# EAGLE design TRSW and RXamp FINAL mods (EAGLE 6.2)

## Sheet 1 of 2
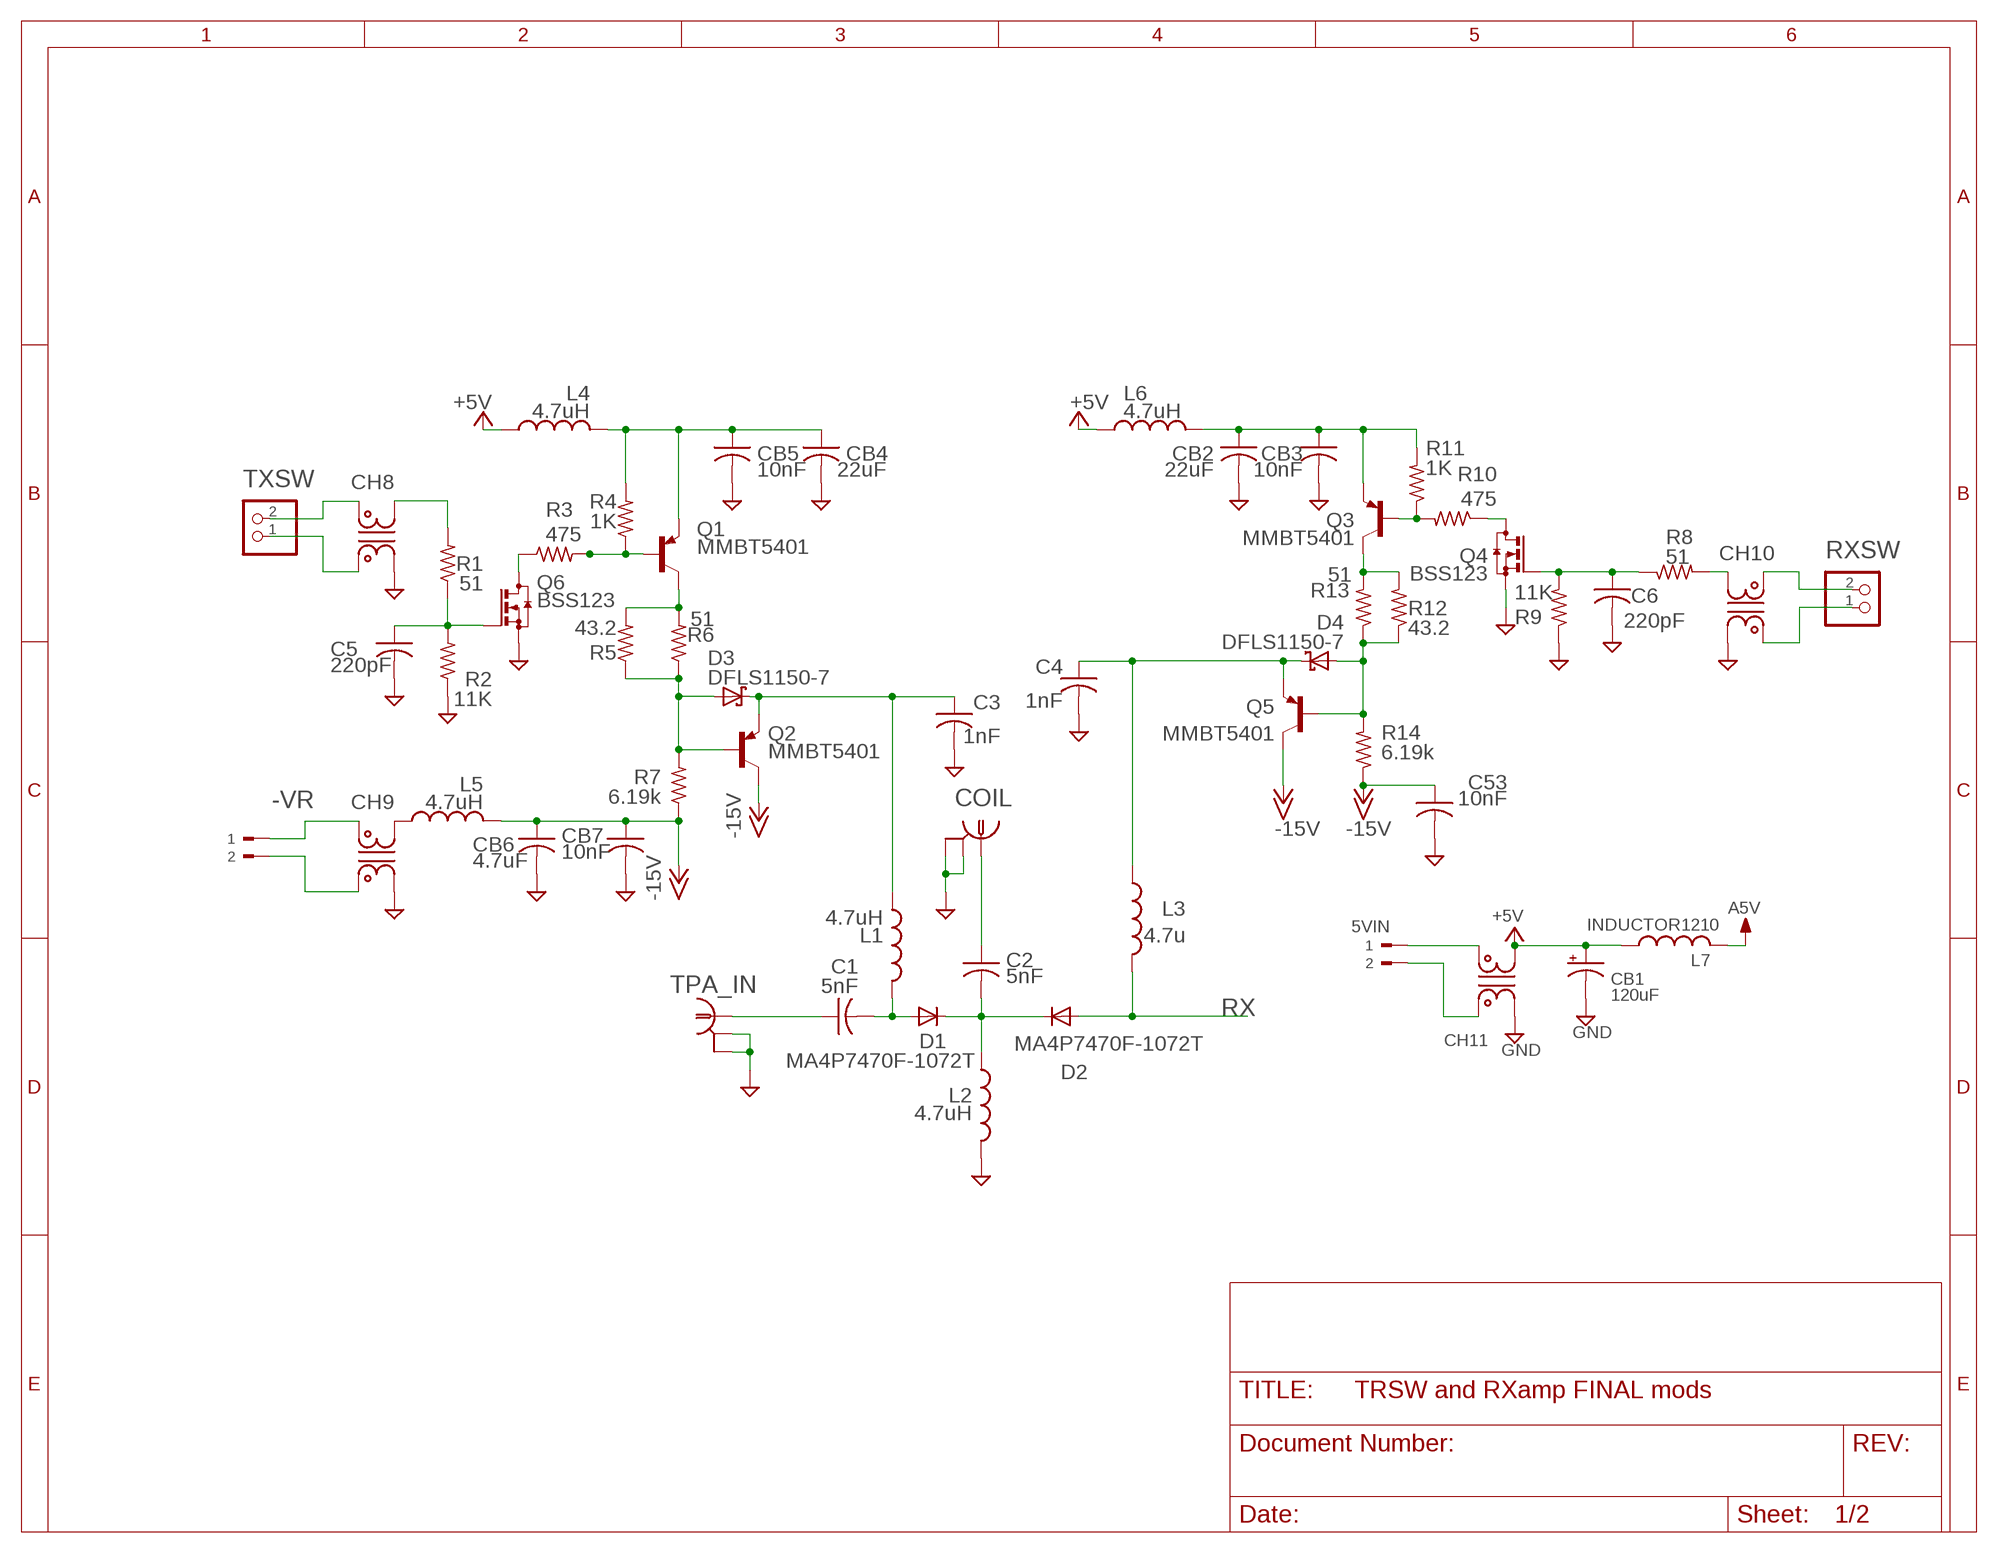
[diagram p0: schematic, sheet 1]

### Parts
5VIN  TERM-2OMNIMATE_SL  [OMNIMATE_SL_2POS]
-VR  TERM-2OMNIMATE_SL  [OMNIMATE_SL_2POS]
C1  5nF  CAPACITOR1008  [1008]
C2  5nF  CAPACITOR1008  [1008]
C3  1nF  C-USC0805  [C0805]
C4  1nF  C-USC0805  [C0805]
C5  220pF  C-USC0805  [C0805]
C6  220pF  C-USC0805  [C0805]
C53  10nF  C-USC0603  [C0603]
CB1  120uF  CPOL-USE3.5-8  [E3,5-8]
CB2  22uF  C-USC0805  [C0805]
CB3  10nF  C-USC0603  [C0603]
CB4  22uF  C-USC0805  [C0805]
CB5  10nF  C-USC0603  [C0603]
CB6  4.7uF  C-USC0805  [C0805]
CB7  10nF  C-USC0603  [C0603]
CH8  CHOKEDLW31S  [CHOKE_DLW31S]
CH9  CHOKE  [CHOKE_DLW5BT]
CH10  CHOKEDLW31S  [CHOKE_DLW31S]
CH11  CHOKE  [CHOKE_DLW5BT]
COIL  BNC-EDGE  [BNC-EDGE]
D1  MA4P7470F-1072T  DIODE  [1210-POLAR]
D2  MA4P7470F-1072T  DIODE  [1210-POLAR]
D3  DFLS1150-7  DIODE-SCHOTTKYPOWERDI-123  [POWERDI-123]
D4  DFLS1150-7  DIODE-SCHOTTKYPOWERDI-123  [POWERDI-123]
L1  4.7uH  INDUCTOR1210  [1210]
L2  4.7uH  INDUCTOR1210  [1210]
L3  4.7u  INDUCTOR1210  [1210]
L4  4.7uH  INDUCTOR1210  [1210]
L5  4.7uH  INDUCTOR1210  [1210]
L6  4.7uH  INDUCTOR1210  [1210]
L7  INDUCTOR1210  [1210]
Q1  MMBT5401  BF821SMD  [SOT23-BEC]
Q2  MMBT5401  BF821SMD  [SOT23-BEC]
Q3  MMBT5401  BF821SMD  [SOT23-BEC]
Q4  BSS123  [SOT23]
Q5  MMBT5401  BF821SMD  [SOT23-BEC]
Q6  BSS123  [SOT23]
R1  51  R-US_R0805  [R0805]
R2  11K  R-US_R0805  [R0805]
R3  475  R-US_R0805  [R0805]
R4  1K  R-US_R0805  [R0805]
R5  43.2  R-US_R0805  [R0805]
R6  51  R-US_R0805  [R0805]
R7  6.19k  R-US_R0805  [R0805]
R8  51  R-US_R0805  [R0805]
R9  11K  R-US_R0805  [R0805]
R10  475  R-US_R0805  [R0805]
R11  1K  R-US_R0805  [R0805]
R12  43.2  R-US_R0805  [R0805]
R13  51  R-US_R0805  [R0805]
R14  6.19k  R-US_R0805  [R0805]
RXSW  PINHD-1X2  [1X02]
TPA_IN  BNC-EDGE  [BNC-EDGE]
TXSW  PINHD-1X2  [1X02]

### Nets
+5V: CB1.+ CH11.P$3 L4.1 L6.2 L7.1
-15V: C53.1 CB6.1 CB7.1 L5.2 Q2.C Q5.C R7.1 R14.1
A5V: L7.2 ; also sheet 2
GND: C3.2 C4.2 C5.2 C6.2 C53.2 CB1.- CB2.2 CB3.2 CB4.2 CB5.2 CB6.2 CB7.2 CH8.P$2 CH9.P$2 CH10.P$2 CH11.P$2 COIL.S1(GND1) COIL.S2(GND2) L2.2 Q4.2(S) Q6.2(S) R2.1 R9.1 TPA_IN.S1(GND1) TPA_IN.S2(GND2) ; also sheet 2
LNAIN: D2.A L3.2 ; also sheet 2
N$1: D3.A Q2.B R5.1 R6.1 R7.2
N$2: C3.1 D3.K(C) L1.1 Q2.E
N$3: Q1.C R5.2 R6.2
N$4: Q1.B R3.2 R4.1
N$5: CH9.P$3 L5.1
N$6: C1.P$1 TPA_IN.I
N$7: C1.P$2 D1.A L1.2
N$8: C2.P$2 D1.K(C) D2.K(C) L2.1
N$12: CH8.P$3 R1.2
N$13: C2.P$1 COIL.I
N$15: CH10.P$3 R8.2
N$16: CH10.P$4 RXSW.2
N$17: CH10.P$1 RXSW.1
N$18: CH8.P$4 TXSW.2
N$19: CH8.P$1 TXSW.1
N$22: 5VIN.1 CH11.P$4
N$23: 5VIN.2 CH11.P$1
N$24: -VR.1 CH9.P$4
N$25: -VR.2 CH9.P$1
N$29: D4.A Q5.B R12.1 R13.1 R14.2
N$36: C4.1 D4.K(C) L3.1 Q5.E
N$37: Q3.C R12.2 R13.2
N$38: Q3.B R10.2 R11.1
N$109: C6.1 Q4.1(G) R8.1 R9.2
N$110: Q6.3(D) R3.1
N$111: Q4.3(D) R10.1
N$112: C5.1 Q6.1(G) R1.1 R2.2
N$113: CB4.1 CB5.1 L4.2 Q1.E R4.2
N$114: CB2.1 CB3.1 L6.1 Q3.E R11.2

### Notes on the sheet
- RX

## Sheet 2 of 2
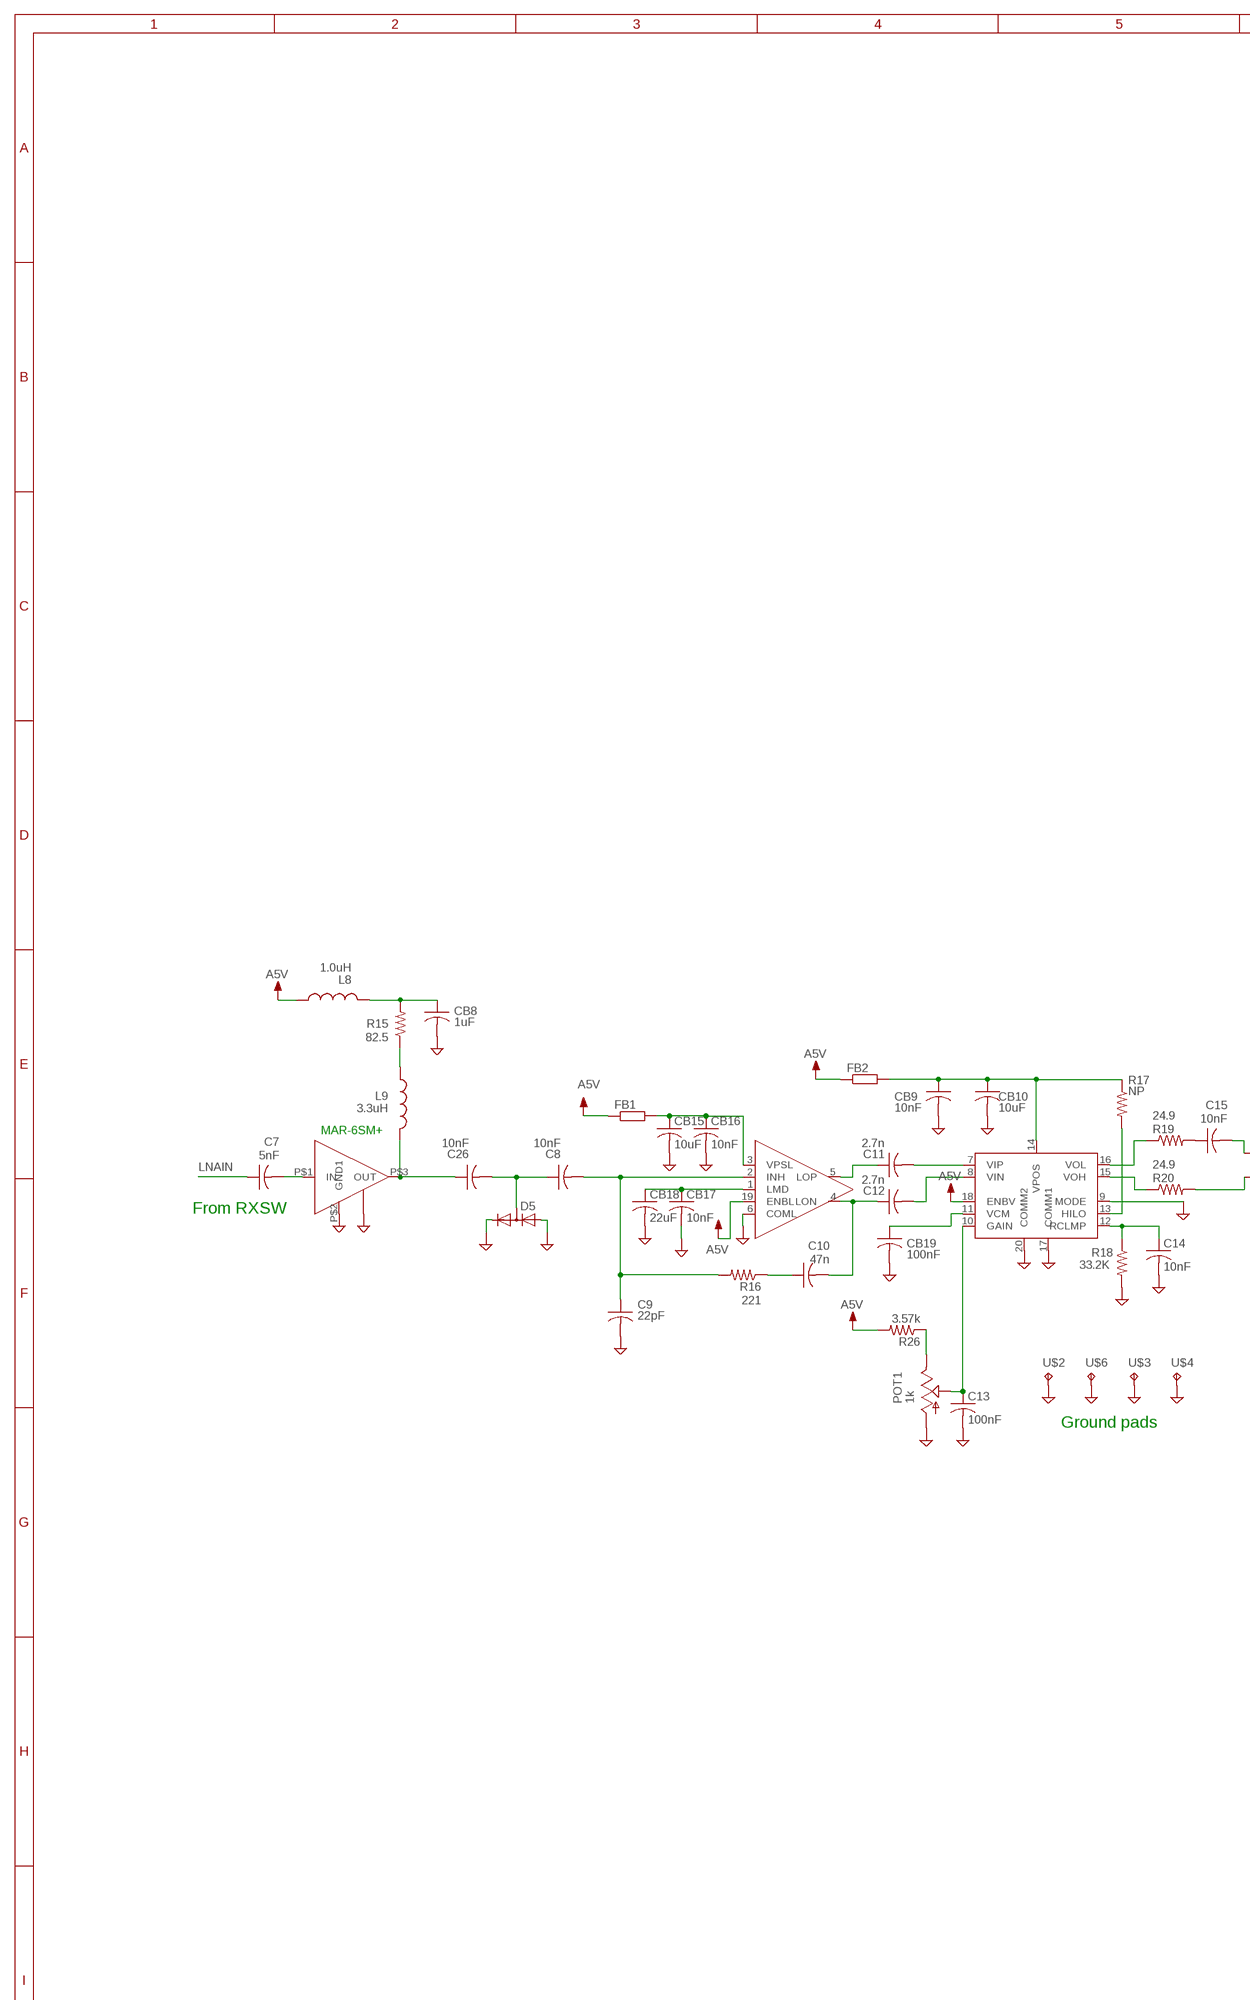
[diagram p1: schematic, sheet 2, part 1 of 2]
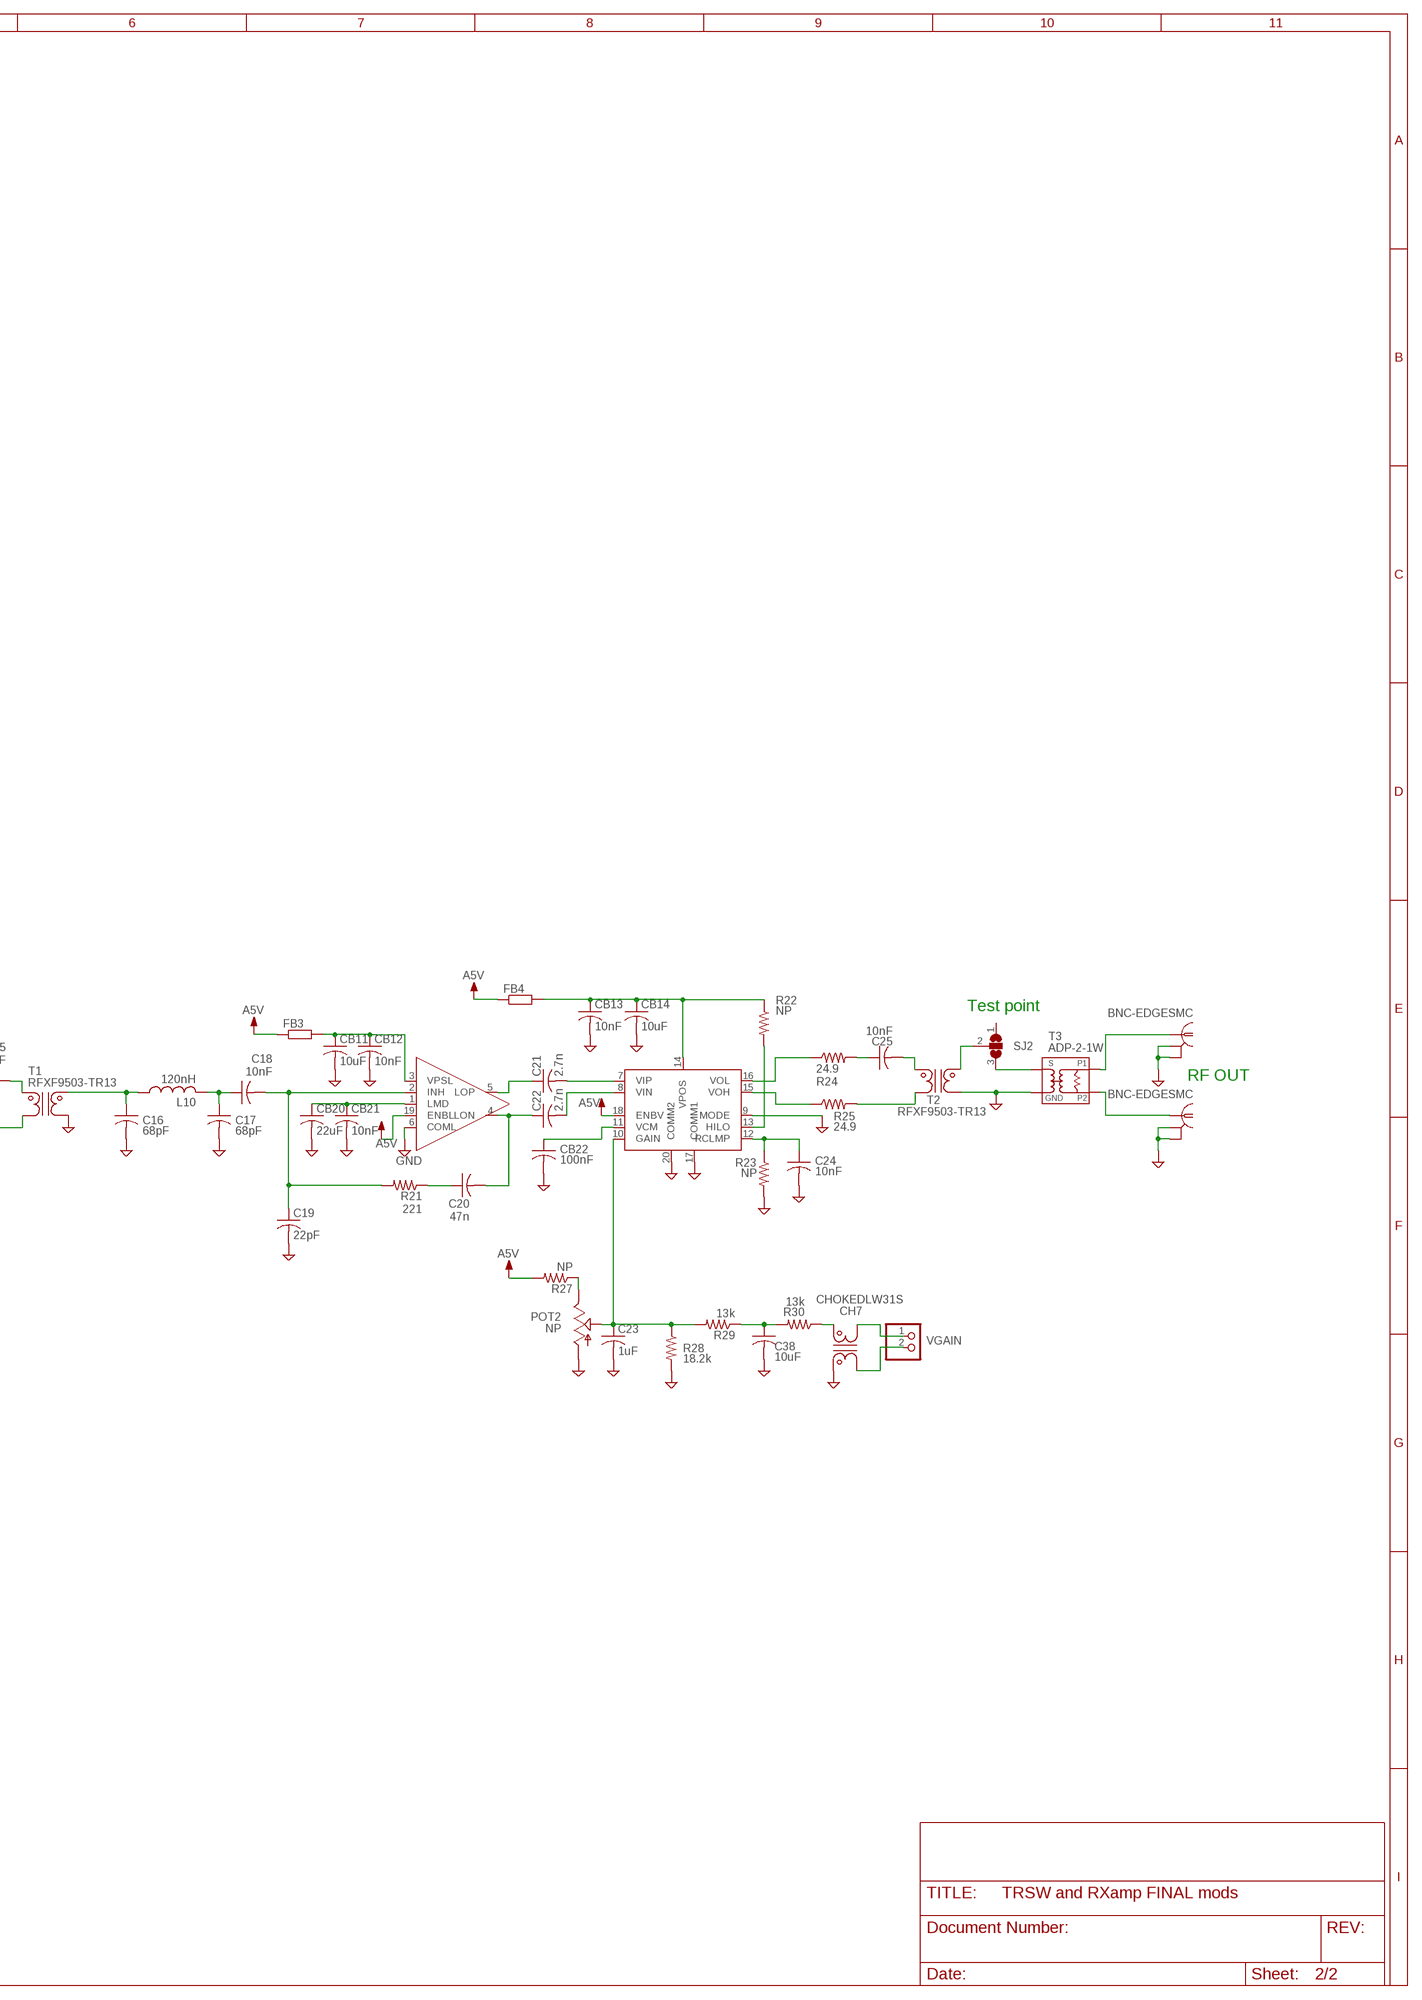
[diagram p2: schematic, sheet 2, part 2 of 2]

### Parts
C7  5nF  CAPACITOR1008  [1008]
C8  10nF  C-USC0805  [C0805]
C9  22pF  C-USC0805  [C0805]
C10  47n  C-USC0805  [C0805]
C11  2.7n  C-USC0603  [C0603]
C12  2.7n  C-USC0603  [C0603]
C13  100nF  C-USC0603  [C0603]
C14  10nF  C-USC0603  [C0603]
C15  10nF  C-USC0603  [C0603]
C16  68pF  CAPACITOR1008  [1008]
C17  68pF  CAPACITOR1008  [1008]
C18  10nF  C-USC0805  [C0805]
C19  22pF  C-USC0805  [C0805]
C20  47n  C-USC0805  [C0805]
C21  2.7n  C-USC0603  [C0603]
C22  2.7n  C-USC0603  [C0603]
C23  1uF  C-USC0805  [C0805]
C24  10nF  C-USC0603  [C0603]
C25  10nF  C-USC0603  [C0603]
C26  10nF  C-USC0805  [C0805]
C38  10uF  C-USC0805  [C0805]
CB8  1uF  C-USC0805  [C0805]
CB9  10nF  C-USC0603  [C0603]
CB10  10uF  C-USC0805  [C0805]
CB11  10uF  C-USC0805  [C0805]
CB12  10nF  C-USC0603  [C0603]
CB13  10nF  C-USC0603  [C0603]
CB14  10uF  C-USC0805  [C0805]
CB15  10uF  C-USC0805  [C0805]
CB16  10nF  C-USC0603  [C0603]
CB17  10nF  C-USC0603  [C0603]
CB18  22uF  C-USC0805  [C0805]
CB19  100nF  C-USC0603  [C0603]
CB20  22uF  C-USC0805  [C0805]
CB21  10nF  C-USC0603  [C0603]
CB22  100nF  C-USC0603  [C0603]
CH7  CHOKEDLW31S  [CHOKE_DLW31S]
D5  DIODE_2CACA-SOT23  [SOT23]
FB1  R-EU_R0603  [R0603]
FB2  R-EU_R0603  [R0603]
FB3  R-EU_R0603  [R0603]
FB4  R-EU_R0603  [R0603]
L8  1.0uH  INDUCTOR1008  [1008]
L9  3.3uH  INDUCTOR1008  [1008]
L10  120nH  INDUCTOR1008  [1008]
LNA  MAR-6SM+  [WW107]
POT1  1k  TRIM_US-3223W  [3223W]
POT2  NP  TRIM_US-3223W  [3223W]
R15  82.5  R-US_R0805  [R0805]
R16  221  R-US_R0805  [R0805]
R17  NP  R-US_R0805  [R0805]
R18  33.2K  R-US_R0805  [R0805]
R19  24.9  R-US_R0805  [R0805]
R20  24.9  R-US_R0805  [R0805]
R21  221  R-US_R0805  [R0805]
R22  NP  R-US_R0805  [R0805]
R23  NP  R-US_R0805  [R0805]
R24  24.9  R-US_R0805  [R0805]
R25  24.9  R-US_R0805  [R0805]
R26  3.57k  R-US_R0805  [R0805]
R27  NP  R-US_R0805  [R0805]
R28  18.2k  R-US_R0805  [R0805]
R29  13k  R-US_R0805  [R0805]
R30  13k  R-US_R0805  [R0805]
RF_OUT  BNC-EDGESMC  [SMC-EDGE]
SJ2  SJ2W  [SJ_2]
T1  RFXF9503-TR13  BALUN_1:1  [CX20XX_BALUN]
T2  RFXF9503-TR13  BALUN_1:1  [CX20XX_BALUN]
T3  ADP-2-1W  [CD636]
U1  AD8331  [QSOP-20]
U2  AD8331  [QSOP-20]
U$2  TESTPOINTKEYSTONE_ELECTRONICS_5016  [SMD_TESTPAD]
U$3  TESTPOINTKEYSTONE_ELECTRONICS_5016  [SMD_TESTPAD]
U$4  TESTPOINTKEYSTONE_ELECTRONICS_5016  [SMD_TESTPAD]
U$6  SOLDERPADSMALL  [PAD-SMALL]
U$27  BNC-EDGESMC  [SMC-EDGE]
VGAIN  PINHD-1X2  [1X02]

### Nets
A5V: FB1.1 FB2.1 FB3.1 FB4.1 L8.P$1 R26.2 R27.2 U1.18(ENBV) U1.19(ENBL) U2.18(ENBV) U2.19(ENBL) ; also sheet 1
GND: C9.2 C13.2 C14.2 C16.P$2 C17.P$2 C19.2 C23.2 C24.2 C38.2 CB8.2 CB9.2 CB10.2 CB11.2 CB12.2 CB13.2 CB14.2 CB15.2 CB16.2 CB17.2 CB18.2 CB19.2 CB20.2 CB21.2 CB22.2 CH7.P$1 D5.1(A) D5.2(C) LNA.P$2(GND1) LNA.P$4(GND2) POT1.1(A) POT2.1(A) R18.2 R23.2 R28.2 RF_OUT.2(GND1) RF_OUT.3(GND2) T1.P$3 T2.P$3 T3.P$6(GND) U1.6(COML) U1.9(MODE) U1.17(COMM1) U1.20(COMM2) U2.6(COML) U2.9(MODE) U2.17(COMM1) U2.20(COMM2) U$2.P$1(TP) U$3.P$1(TP) U$4.P$1(TP) U$6.P$1(TP) U$27.2(GND1) U$27.3(GND2) ; also sheet 1
LNAIN: C7.P$1 ; also sheet 1
N$9: C16.P$1 L10.P$1 T1.P$4
N$10: C17.P$1 C18.1 L10.P$2
N$11: C8.2 C9.1 R16.2 U1.2(INH)
N$14: CH7.P$4 R30.1
N$20: CH7.P$3 VGAIN.1
N$21: CH7.P$2 VGAIN.2
N$26: C8.1 C26.2 D5.3(AC)
N$27: C26.1 L9.P$2 LNA.P$3(OUT)
N$28: L9.P$1 R15.1
N$30: CB8.1 L8.P$2 R15.2
N$31: C7.P$2 LNA.P$1(IN)
N$32: C11.1 U1.5(LOP)
N$33: C11.2 U1.7(VIP)
N$34: C12.2 U1.8(VIN)
N$35: C10.2 C12.1 U1.4(LON)
N$42: C15.1 R19.2
N$43: C10.1 R16.1
N$44: CB17.1 CB18.1 U1.1(LMD)
N$45: CB15.1 CB16.1 FB1.2 U1.3(VPSL)
N$46: CB19.1 U1.11(VCM)
N$47: R19.1 U1.16(VOL)
N$48: R20.1 U1.15(VOH)
N$49: C14.1 R18.1 U1.12(RCLMP)
N$53: CB9.1 CB10.1 FB2.2 R17.1 U1.14(VPOS)
N$54: R20.2 T1.P$1
N$55: R17.2 U1.13(HILO)
N$56: C15.2 T1.P$5
N$58: C13.1 POT1.2(S) U1.10(GAIN)
N$68: POT1.3(E) R26.1
N$73: C18.2 C19.1 R21.2 U2.2(INH)
N$76: C21.1 U2.5(LOP)
N$77: C21.2 U2.7(VIP)
N$78: C22.2 U2.8(VIN)
N$81: C20.2 C22.1 U2.4(LON)
N$82: C20.1 R21.1
N$83: CB20.1 CB21.1 U2.1(LMD)
N$84: CB11.1 CB12.1 FB3.2 U2.3(VPSL)
N$87: CB22.1 U2.11(VCM)
N$89: R24.1 U2.16(VOL)
N$90: R25.1 U2.15(VOH)
N$91: C24.1 R23.1 U2.12(RCLMP)
N$92: CB13.1 CB14.1 FB4.2 R22.1 U2.14(VPOS)
N$93: R22.2 U2.13(HILO)
N$94: C25.1 R24.2
N$95: R25.2 T2.P$1
N$96: C25.2 T2.P$5
N$97: C23.1 POT2.2(S) R28.1 R29.2 U2.10(GAIN)
N$98: POT2.3(E) R27.1
N$99: T3.P$4(P2) U$27.1
N$100: RF_OUT.1 T3.P$3(P1)
N$101: SJ2.2 T2.P$4
N$102: SJ2.3 T3.P$1(S)
RTY5: C38.1 R29.1 R30.2
Unconnected: SJ2.1

### Notes on the sheet
- Test point
- MAR-6SM+
- RF OUT
- From RXSW
- Ground pads

## Library data of the parts
5VIN -VR = amyparts-rf-combined:TERM-2
C1 C2 C7 C16 C17 = amyparts-rf:CAPACITOR
C3-C6 C8-C15 C18-C26 C38 C53 CB2-CB22 = rcl:C-US: CAPACITOR, American symbol
CB1 = rcl:CPOL-US: POLARIZED CAPACITOR, American symbol
CH7-CH11 = amyparts-rf-combined:CHOKE
COIL RF_OUT TPA_IN U$27 = amyparts-rf:BNC-EDGE
D1 D2 = amyparts-rf-combined:DIODE
D3 D4 = amyparts-rf:DIODE-SCHOTTKY
D5 = diode:DIODE_2CACA-: 2 Diodes - Cathode-Anode|Cathode-Anode
FB1-FB4 = rcl:R-EU_: RESISTOR, European symbol
L1-L10 = amyparts-rf:INDUCTOR
LNA = amyparts-rf:MAR-6SM+
POT1 POT2 = amyparts-rf-combined:TRIM_US-: POTENTIOMETER
Q1-Q3 Q5 = transistor-pnp:BF821*: PNP Transistror
Q4 Q6 = transistor-small-signal:BSS123: N-CHANNEL MOS FET
R1-R30 = rcl:R-US_: RESISTOR, American symbol
RXSW TXSW VGAIN = pinhead:PINHD-1X2: PIN HEADER
SJ2 = jumper:SJ2W: SMD solder JUMPER
T1 T2 = amyparts-rf-combined:BALUN_1:1
T3 = amyparts-rf-combined:ADP-2-1W
U1 U2 = amyparts-rf-combined:AD8331
U$2-U$4 = amyparts-rf-combined:TESTPOINT
U$6 = amyparts-rf-combined:SOLDERPAD

## Board
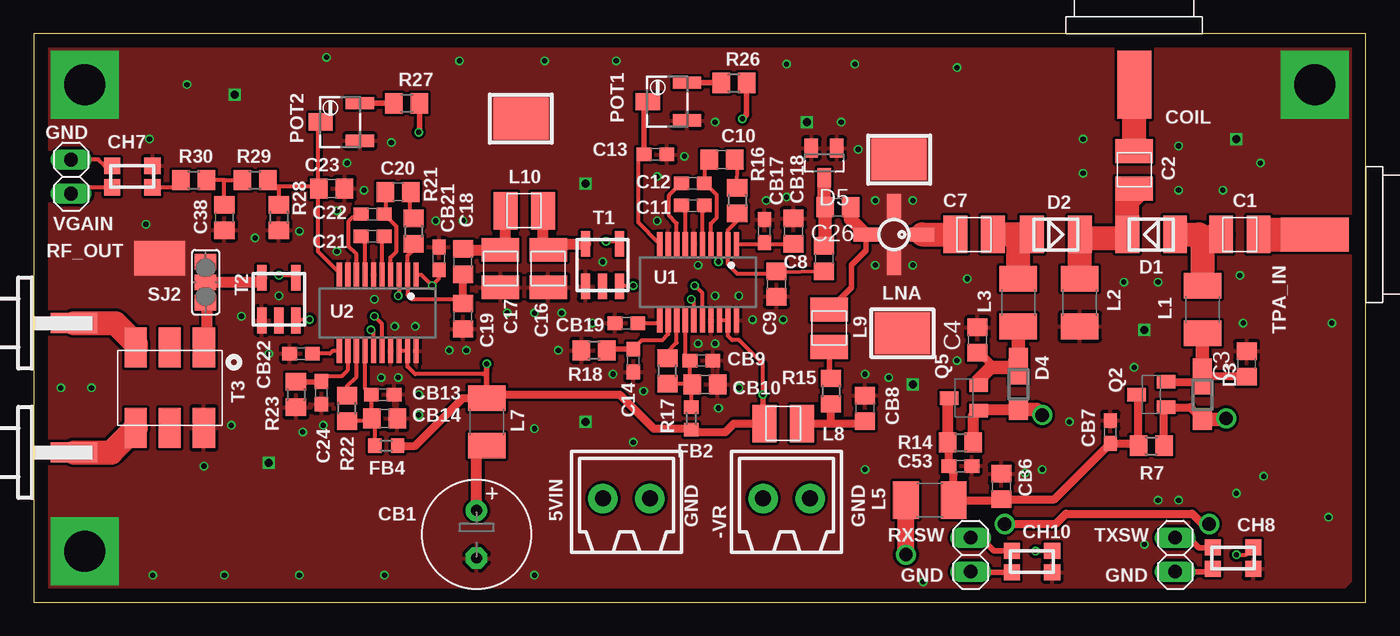
[diagram p3: board, top side]
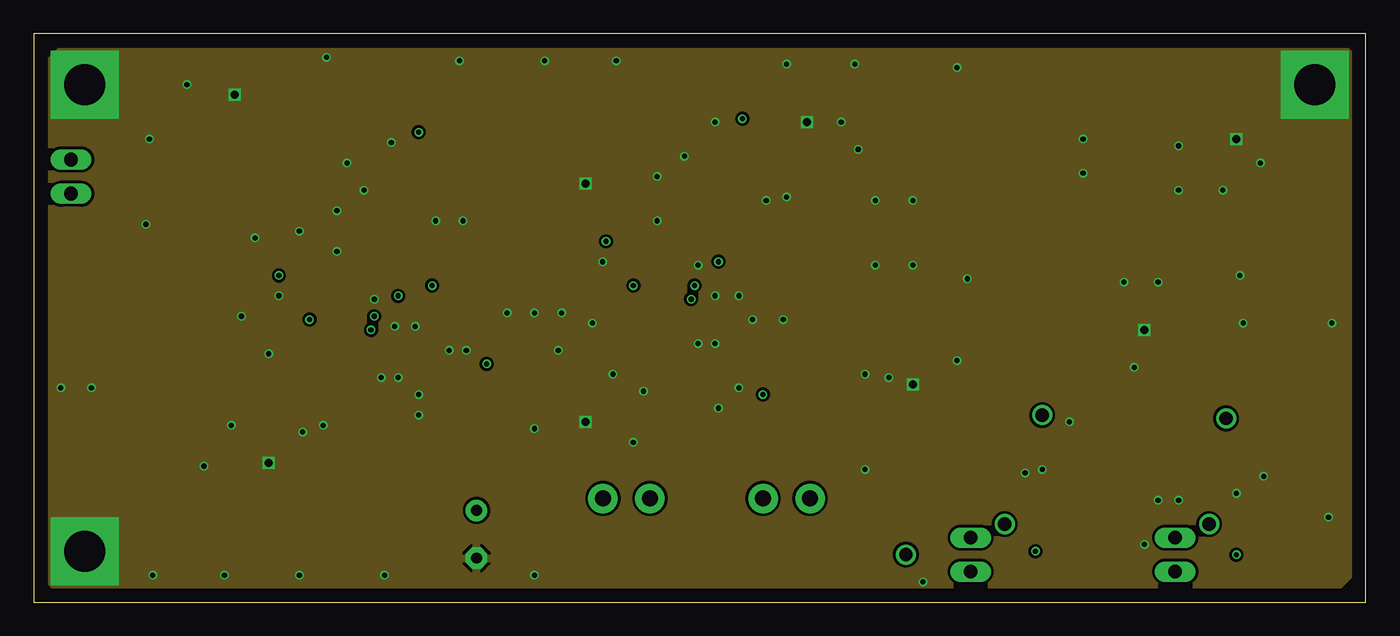
[diagram p4: board, inner layer Route15]
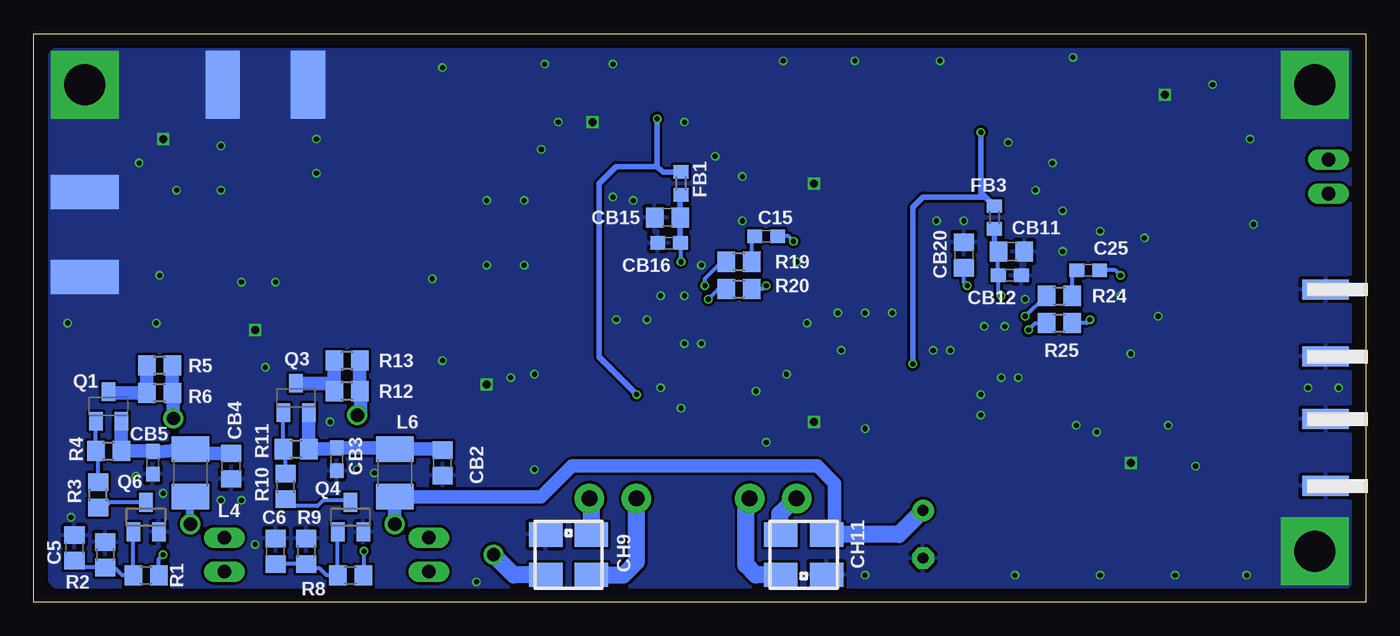
[diagram p5: board, bottom side, seen from below]

Size 99.31 x 42.42 mm. Coordinates in mm from the lower left corner, seen from the top.
Outline: 99.31,42.42 0,42.42 0,0 99.31,0 99.31,42.42
Copper layers (1*2+15*16): Top 0.035mm / dielectric 1.5mm / Route2 0.035mm / dielectric 0.15mm / Route15 0.035mm / dielectric 0.2mm / Bottom 0.035mm
Design rules: minimum track width 10mil, minimum drill 15mil, track to track 8mil, track to pad 8mil, pad to pad 8mil, via to via 8mil, smd to smd 2mil, copper to edge 40mil, drill to drill 8mil, minimum pad ring 5mil, minimum via ring 5mil, stop-mask expansion 4mil, vias tented up to drill 0mil, thermal gap 10mil

### Footprints (pad centres in the part's own frame; a part is rotated, then mirrored left to right if it is on the bottom)
OMNIMATE_SL_2POS = drill 1.2 pad 2.2: 1 -1.75,0; 2 1.75,0
1008 = smd 1.778 x 2.794: P$1 -1.397,0; P$2 1.397,0
C0805 = smd 1.3 x 1.5: 1 -0.95,0; 2 0.95,0
C0603 = smd 1.1 x 1: 1 -0.85,0; 2 0.85,0
E3,5-8 = drill 0.813 pad 1.6: + -1.778,0 | drill 0.813 pad 1.6 octagon: - 1.778,0
CHOKE_DLW31S = smd 1.2 x 1.2: P$1 -1.5,-0.8; P$2 1.5,-0.8; P$3 1.5,0.8; P$4 -1.5,0.8
CHOKE_DLW5BT = smd 2.5 x 1.8: P$1 -1.7,-1.5; P$2 1.7,-1.5; P$3 1.7,1.5; P$4 -1.7,1.5
BNC-EDGE = smd 5.08 x 2.54: I 2.54,0 | smd 5.08 x 2.54 bottom: S1 2.54,3.175; S2 2.54,-3.175
1210-POLAR = smd 1.778 x 2.794: A -1.778,0; K 1.778,0
POWERDI-123 = smd 1.6 x 1.4: A 1.85,0 | smd 2.7 x 1.4: K -1.35,0
SOT23 = smd 1 x 1.4: 1 -0.95,-1.1; 2 0.95,-1.1; 3 0,1.1
R0603 = smd 1 x 1.1: 1 -0.85,0; 2 0.85,0
1210 = smd 1.905 x 2.794: 1 -1.778,0; 2 1.778,0
WW107 = smd 1.05 x 1.85: P$1 0,-2.1; P$3 0,2.1 | smd 1.85 x 1.05: P$2 2.1,0; P$4 -2.1,0
3223W = smd 0.9 x 2.108: 1 -1.4,-1.469; 3 1.4,-1.469 | smd 1.3 x 1.808: 2 0,1.469
SOT23-BEC = smd 1 x 1.4: B -0.95,-1.1; C 0,1.1; E 0.95,-1.1
R0805 = smd 1.3 x 1.5: 1 -0.95,0; 2 0.95,0
SMC-EDGE = smd 3.5 x 1.5: 1 3.14,0 | smd 3.5 x 1.5 bottom: 2 3.14,2.5; 3 3.14,-2.5
1X02 = drill 1.016 long: 1 -1.27,0; 2 1.27,0
SJ_2 = smd 1.168 x 1.6: 1 -1.524,0; 2 0,0; 3 1.524,0
CX20XX_BALUN = smd 0.762 x 1.905: P$1 1.27,-1.587; P$2 0,-1.587; P$3 -1.27,-1.587; P$4 -1.27,1.587; P$5 1.27,1.587
CD636 = smd 1.65 x 3: P$1 -2.54,-3; P$2 0,-3; P$3 2.54,-3; P$4 2.54,3; P$5 0,3; P$6 -2.54,3
QSOP-20 = smd 0.381 x 1.778: 1 -2.857,-2.854; 2 -2.223,-2.854; 3 -1.587,-2.854; 4 -0.953,-2.854; 5 -0.318,-2.854; 6 0.318,-2.854; 7 0.953,-2.854; 8 1.587,-2.854; 9 2.223,-2.854; 10 2.857,-2.854; 11 2.857,2.854; 12 2.223,2.854; 13 1.587,2.854; 14 0.953,2.854; 15 0.318,2.854; 16 -0.318,2.854; 17 -0.953,2.854; 18 -1.587,2.854; 19 -2.223,2.854; 20 -2.857,2.854
SMD_TESTPAD = smd 4.1 x 3.1: P$1 0,0
PAD-SMALL = smd 3.81 x 2.54: P$1 0,0

### Placement (x,y rotation side)
5VIN  44.2,7.75 0 top
-VR  56.13,7.75 0 top
C1  89.92,27.43 180 top
C2  82.04,32.26 270 top
C3  90.42,17.78 90 top
C4  70.36,19.56 90 top
C5  96.27,4.06 90 bottom
C6  81.28,3.81 90 bottom
C7  70.1,27.43 180 top
C8  58.93,25.65 270 top
C9  55.37,23.75 270 top
C10  51.31,33.02 180 top
C11  49.15,29.59 180 top
C12  49.15,31.24 180 top
C13  46.35,33.4 0 top
C14  44.7,18.03 270 top
C15  44.7,27.3 0 bottom
C16  38.35,24.89 270 top
C17  34.8,24.89 270 top
C18  32,25.4 270 top
C19  32,21.34 270 top
C20  27.18,30.61 180 top
C21  25.27,27.3 180 top
C22  25.27,28.96 180 top
C23  22.23,30.86 0 top
C24  21.46,15.62 270 top
C25  20.7,24.77 0 bottom
C26  59.94,29.46 180 top
C38  14.22,28.7 270 top
C53  69.09,10.16 0 top
CB1  33.02,5.08 270 top
CB2  68.83,10.41 270 bottom
CB3  76.71,10.67 270 bottom
CB4  84.58,10.16 270 bottom
CB5  90.42,10.41 270 bottom
CB6  72.14,8.64 90 top
CB7  80.26,12.7 90 top
CB8  61.98,14.48 90 top
CB9  49.78,18.03 0 top
CB10  50.04,16.26 0 top
CB11  26.42,26.16 0 bottom
CB12  26.54,24.38 0 bottom
CB13  26.04,15.49 0 top
CB14  26.16,13.72 0 top
CB15  52.07,28.7 180 bottom
CB16  51.94,26.8 180 bottom
CB17  54.48,27.69 90 top
CB18  56.64,27.69 90 top
CB19  44.2,20.83 180 top
CB20  29.97,25.91 90 bottom
CB21  30.23,25.65 90 top
CB22  19.94,18.54 180 top
CH7  7.37,31.75 180 top
CH8  89.41,3.3 0 top
CH9  59.44,3.56 180 bottom
CH10  74.42,3.05 0 top
CH11  41.91,3.56 0 bottom
COIL  82.04,41.15 270 top
D1  83.31,27.43 180 top
D2  76.2,27.43 0 top
D3  87.12,15.49 270 top
D4  73.41,16.26 270 top
D5  58.93,32.77 180 top
FB1  51.05,31.24 270 bottom
FB2  49.02,13.72 90 top
FB3  27.69,28.7 270 bottom
FB4  26.29,11.68 180 top
L1  87.12,21.84 90 top
L2  77.98,22.35 270 top
L3  73.41,22.35 90 top
L4  87.63,9.65 90 bottom
L5  66.8,7.62 0 top
L6  72.39,9.65 270 bottom
L7  33.78,13.46 90 top
L8  55.88,13.34 0 top
L9  59.31,20.45 90 top
L10  36.58,29.21 180 top
LNA  64.14,27.43 90 top
POT1  47.24,37.34 90 top
POT2  22.86,35.81 90 top
Q1  93.73,14.61 0 bottom
Q2  83.31,15.49 90 top
Q3  79.76,15.24 0 bottom
Q4  75.69,6.35 0 bottom
Q5  69.34,15.24 90 top
Q6  90.93,6.35 0 bottom
R1  90.93,2.03 0 bottom
R2  93.98,3.56 270 bottom
R3  94.49,8 90 bottom
R4  93.73,11.3 0 bottom
R5  89.92,17.65 180 bottom
R6  89.92,15.62 180 bottom
R7  83.31,11.68 0 top
R8  75.69,2.03 0 bottom
R9  78.99,3.81 270 bottom
R10  80.52,8.64 90 bottom
R11  79.76,11.43 0 bottom
R12  75.95,15.75 180 bottom
R13  75.95,18.03 180 bottom
R14  69.09,11.94 0 top
R15  59.44,15.75 270 top
R16  52.45,29.97 270 top
R17  47.24,17.27 90 top
R18  41.78,18.8 180 top
R19  46.74,25.4 0 bottom
R20  46.74,23.37 0 bottom
R21  28.32,27.69 270 top
R22  23.37,14.48 90 top
R23  19.56,15.49 270 top
R24  22.86,22.86 0 bottom
R25  22.86,20.83 0 bottom
R26  52.2,38.73 0 top
R27  27.81,37.21 0 top
R28  18.29,28.7 270 top
R29  16.51,31.5 0 top
R30  11.94,31.5 0 top
RF_OUT  -0.13,20.83 0 top
RXSW  69.85,3.56 90 top
SJ2  12.83,23.88 270 top
T1  42.42,25.15 0 top
T2  18.29,22.61 0 top
T3  10.16,16 180 top
TPA_IN  98.04,27.43 180 top
TXSW  85.09,3.56 90 top
U1  49.53,23.88 180 top
U2  25.65,21.59 180 top
U$2  64.77,20.07 0 top
U$3  64.52,33.02 180 top
U$4  36.32,36.07 0 top
U$6  9.4,25.65 180 top
U$27  -0.13,11.18 0 top
VGAIN  2.79,31.75 90 top

### Tracks (layer width: path | path; a pad name or v marks a point on that pad's centre or on a via)
+5V  (via drill 1)
  Top 0.61: v72.39,5.84 76.2,5.84 76.96,6.6 86.36,6.6 87.38,5.59 v87.63,5.84
  Top 0.813: CB1.+ 33.02,11.43 L7.1
  Bottom 0.61: v87.63,5.84 L4.1
  Bottom 1.016: v72.39,5.84 L6.2 61.47,7.87 59.18,10.16 40.89,10.16 39.62,8.89 39.62,5.06
  Bottom 1.27: CH11.P$3 39.62,5.06 34.82,5.06 CB1.+
-15V
  Top 0.61: Q2.C 82.36,15.34 R7.1 82.2,11.85 CB7.1 76.1,7.69 CB6.1 71.82,7.62 L5.2 68.58,9.56 C53.1 68.24,11.33 R14.1
  Top 0.813: R14.1 68.14,15.14 Q5.C
A5V  (via drill 0.38)
  Top 0.305: U1.18 U1.19 51.75,19.88 52.07,19.56 52.58,19.56 54.36,17.78 v54.36,15.49 | U2.18 U2.19 27.88,17.59 28.45,17.02 33.53,17.02 33.78,17.27
  Top 0.406: R27.2 28.76,35.11 v28.7,35.05 | L7.2 33.78,17.27 v33.78,17.78 | R26.2 53.15,36.38 v52.83,36.07 | v54.36,15.49 54.36,12.95 L8.P$1
  Top 0.61: FB4.1 28.45,11.68 32,15.24 L7.2 34.04,15.49 43.69,15.49 46.23,12.95 48.77,12.95 48.86,12.87 FB2.1 48.77,12.79 49.02,12.95 | 49.02,12.95 49.4,12.83 49.02,12.95 | 49.02,12.95 49.28,12.7 51.56,12.7 52.2,13.34 L8.P$1
  Bottom 0.406: v28.7,35.05 28.7,30.57 FB3.1 28.36,30.23 33.02,30.23 33.78,29.46 v33.78,17.78 | 52.83,32.51 v52.83,36.07 | 52.83,32.51 55.88,32.51 57.15,31.24 57.15,18.29 v54.36,15.49 | FB1.1 52.41,32.09 52.83,32.51
GND  (via drill 0.38, 0.6, 3.05 pad 5.08)
  other vias: 3.81,38.61 3.81,3.81 95.5,38.61 11.43,38.61 23.37,32.77 26.67,34.29 22.61,26.16 15.49,21.34 17.53,18.54 14.73,13.21 12.7,10.16 2.03,16 4.32,16 28.7,13.97 28.7,15.49 25.91,16.76 27.18,16.76 20.07,12.7 21.59,13.21 30.99,18.8 32.26,18.8 26.92,20.57 25.4,22.61 28.45,20.57 22.61,29.21 35.31,21.59 37.34,21.59 39.37,21.59 41.66,20.83 39.12,18.8 43.18,17.02 45.47,15.75 52.58,16 51.05,14.48 49.53,19.3 50.8,19.3 50.8,22.86 53.59,21.08 52.58,22.86 49.53,25.15 46.48,28.45 42.42,25.4 48.51,33.27 50.8,35.81 46.48,31.75 54.61,29.97 56.13,30.23 55.88,21.08 61.98,17.02 63.75,16.76 29.97,28.45 32,28.45 8.38,28.19 8.64,34.54 16.51,27.18 19.81,27.69 24.64,30.73 61.47,33.78 73.91,9.65 75.18,9.91 82.8,4.32 83.82,7.62 85.34,7.62 96.52,6.35 91.69,9.4 89.66,8.13 78.23,32 78.23,34.54 62.74,29.97 65.53,29.97 60.2,35.81 62.74,25.15 65.53,25.15 85.34,34.04 85.34,30.73 88.65,30.73 91.44,32.77 89.92,24.38 96.77,20.83 90.17,20.83 81.28,23.88 83.82,23.88 69.6,24.13 82.04,17.53 68.83,18.03 56.13,40.13 61.21,40.13 68.83,39.88 43.43,40.39 38.1,40.39 31.75,40.39 21.84,40.64 37.34,12.95 44.7,11.94 61.98,9.91 8.89,2.03 14.22,2.03 19.81,2.03 26.16,2.03 37.34,2.03 66.29,1.52 18.29,22.86 77.22,13.46 82.8,20.32 65.53,16.26 57.66,35.81 89.66,34.54 41.15,31.24 41.15,13.46 17.53,10.41 14.99,37.85
  pour Top (isolate 0): 1.27,41.91 97.79,41.91 98.55,41.15 98.55,2.03 97.28,0.76 1.52,0.76 0.76,1.52 0.76,41.4
  pour Bottom: 1.52,41.4 97.54,41.4 98.3,40.64 98.3,1.78 97.54,1.02 1.52,1.02 1.02,1.52 1.02,40.89
  pour Route15 (isolate 0): 2.29,41.4 97.54,41.4 98.3,40.64 98.3,2.29 97.28,1.27 1.52,1.27 1.02,1.78 1.02,40.13
LNAIN
  Top 1.778: 73.66,27.43 C7.P$1 | 73.66,27.43 D2.A | L3.2 73.41,27.18 73.66,27.43
N$1  (via drill 1)
  Top 0.61: D3.A 86.22,14.54 Q2.B 84.26,14.39 R7.2
  Top 1.016: D3.A 88.83,13.64 v88.9,13.72
  Bottom 1.016: v88.9,13.72 88.9,15.55 R6.1 R5.1
N$2
  Top 0.61: Q2.E 87.06,16.44 87.12,16.51 87.2,16.51 D3.K 87.14,16.83 C3.1
  Top 1.016: D3.K L1.1
N$3
  Bottom 1.016: R5.2 R6.2 93.64,15.62 Q1.C
N$4
  Bottom 0.305: R3.2 94.49,11.12 R4.1 Q1.B
N$5  (via drill 1)
  Top 1.27: v65.02,3.56 L5.1
  Bottom 1.27: CH9.P$3 63.52,2.06 v65.02,3.56
N$6
  Top 1.422: C1.P$1 91.69,27.43
  Top 2.54: 91.69,27.43 TPA_IN.I
N$7
  Top 1.778: 87.12,27.18 C1.P$2 | 87.12,27.18 L1.2 | D1.A 86.87,27.43 87.12,27.18
N$8
  Top 1.778: C2.P$2 82.04,30.48 81.53,29.97 81.53,27.18 81.28,27.18 | 77.98,27.18 81.28,27.18 | 77.98,27.18 D2.K | 81.28,27.18 D1.K | L2.1 77.98,27.18
N$9
  Top 0.813: T1.P$4 38.8,26.73 C16.P$1 37.97,26.67 L10.P$1
N$10
  Top 0.813: L10.P$2 35.18,26.67 C17.P$1 32.06,26.29 C18.1
N$11
  Top 0.305: R16.2 52.45,28.45 51.75,27.75 U1.2 51.75,25.21 52.45,24.51 55.05,24.51 C9.1 55.43,24.64 C8.2
N$12  (via drill 0.38)
  Top 0.305: v89.66,3.56 90.36,3.56 CH8.P$3
  Bottom 0.305: R1.2 89.98,3.24 v89.66,3.56
N$13
  Top 1.778: C2.P$1 COIL.I
N$14
  Top 0.305: CH7.P$4 10.95,30.95 R30.1
N$15  (via drill 0.38)
  Top 0.305: CH10.P$3 74.71,3.85 v74.68,3.81
  Bottom 0.305: v74.68,3.81 74.68,2.1 R8.2
N$16
  Top 0.406: CH10.P$4 71.59,3.85 70.61,4.83 RXSW.2
N$17
  Top 0.406: CH10.P$1 69.85,2.25 RXSW.1
N$18
  Top 0.406: TXSW.2 86.11,4.83 86.87,4.06 87.87,4.06 CH8.P$4
N$19
  Top 0.406: TXSW.1 87.69,2.29 CH8.P$1
N$20
  Top 0.305: CH7.P$3 3.26,30.95 VGAIN.1
N$21
  Top 0.305: CH7.P$2 5.3,32.55 4.83,33.02 VGAIN.2
N$22
  Bottom 1.27: 5VIN.1 42.55,7.75 43.69,6.6 43.69,5.13 CH11.P$4
N$23
  Bottom 1.27: CH11.P$1 45.49,2.06 46.23,2.79 46.23,7.46 5VIN.2
N$24
  Bottom 1.27: -VR.1 54.38,3.02 55.37,2.03 57.71,2.03 CH9.P$4
N$25
  Bottom 1.27: CH9.P$1 57.74,7.6 -VR.2
N$26
  Top 1.016: C8.1 58.99,26.67 C26.2 58.93,29.53 D5.3
N$27
  Top 0.406: LNA.P$3 62.03,26.22 60.96,25.15 60.96,23.5 L9.P$2
  Top 1.016: C26.1 60.89,28.57 LNA.P$3
N$28
  Top 0.406: L9.P$1 59.31,16.82 R15.1
N$29  (via drill 1)
  Top 0.813: D4.A 70.56,14.41 Q5.B 70.04,13.89 R14.2
  Top 1.016: D4.A 74.75,14.41 v75.18,13.97
  Bottom 1.016: R13.1 R12.1 74.93,15.75 74.93,14.16 v75.18,13.97
N$30
  Top 0.61: 59.44,13.34 61.34,13.34 61.98,13.46 CB8.1 | L8.P$2 59.44,13.34 | 59.44,13.34 R15.2
N$31
  Top 1.778: LNA.P$1 C7.P$2
N$32
  Top 0.305: 49.85,29.06 C11.1 49.85,29.19 U1.5
N$33
  Top 0.305: 48.58,29.19 C11.2 48.58,29.06 U1.7
N$34
  Top 0.305: C12.2 48.01,30.99 47.37,30.35 47.37,28.83 47.94,28.26 U1.8
N$35
  Top 0.305: C10.2 50.16,32.64 50.04,32.51 50.03,31.02 C12.1 50.29,30.99 50.93,30.35 50.93,28.7 50.48,28.26 U1.4
N$36
  Top 0.61: C4.1 70.36,18.8 71.63,17.53
  Top 1.016: Q5.E 70.44,16.59 71.37,17.53 71.63,17.53 73.33,17.53 D4.K 73.15,17.86 73.15,18.03 73.41,18.29 L3.1
N$37
  Bottom 1.016: R12.2 76.9,16.26 | 76.9,16.26 R13.2 | Q3.C 76.98,16.34 76.9,16.26
N$38
  Bottom 0.305: R10.2 80.52,11.24 R11.1 Q3.B
N$42
  Bottom 0.305: R19.2 45.79,27.28 C15.1
N$43
  Top 0.305: C10.1 52.45,32.7 R16.1
N$44
  Top 0.305: U1.1 54.38,26.73 CB17.1 54.58,26.74 CB18.1
N$45  (via drill 0.38)
  Top 0.305: U1.3 51.12,25.46 v51.05,25.4
  Bottom 0.305: v51.05,25.4 51.05,26.76 CB16.1
  Bottom 0.406: FB1.2 51.12,30.33 CB15.1 51.12,26.82 CB16.1
N$46
  Top 0.305: CB19.1 46.48,20.83 U1.11
N$47  (via drill 0.38)
  Top 0.305: U1.16 49.85,23.05 v49.28,23.62
  Bottom 0.305: v49.28,23.62 49.28,24.13 48.01,25.4 R19.1
N$48  (via drill 0.38)
  Top 0.305: U1.15 49.21,22.42 v49.02,22.61
  Bottom 0.305: v49.02,22.61 48.26,23.37 R20.1
N$49
  Top 0.305: C14.1 44.7,18.92 45.34,19.56 46.86,19.56 47.31,20 U1.12
  Top 0.406: C14.1 42.7,18.88 R18.1
N$53
  Top 0.305: U1.14 48.58,18.39 CB9.1 48.93,16.92 CB10.1 49.02,16.7 | R17.1 48.65,16.32 49.02,16.7 | 49.02,16.7 FB2.2
N$54  (via drill 0.38)
  Top 0.305: v44.7,23.62 43.75,23.62 T1.P$1
  Bottom 0.305: R20.2 44.96,23.37 v44.7,23.62
N$55
  Top 0.305: 47.24,18.67 47.94,19.37 U1.13
  Top 0.406: R17.2 47.24,18.67
N$56  (via drill 0.38)
  Top 0.305: v42.67,26.92 43.5,26.92 T1.P$5
  Bottom 0.305: C15.2 43.05,27.3 v42.67,26.92
N$58
  Top 0.305: C13.1 45.09,33.23 45.09,28.32 U1.10
  Top 0.406: C13.1 45.51,37.07 POT1.2
N$68
  Top 0.406: POT1.3 R26.1
N$73
  Top 0.305: R21.2 28.32,26.29 27.88,25.84 U2.2 27.88,22.92 28.19,22.61 31.68,22.61 C19.1
  Top 0.61: C19.1 C18.2
N$76
  Top 0.305: U2.5 25.97,26.9 C21.1
N$77
  Top 0.305: U2.7 24.7,26.77 C21.2
N$78
  Top 0.305: C22.2 23.75,28.7 23.5,28.45 23.5,26.54 24.07,25.97 U2.8
N$81
  Top 0.305: C20.2 26.16,30.48 26.29,30.36 26.29,28.99 C22.1 27.05,28.03 27.05,26.16 26.61,25.72 U2.4
N$82
  Top 0.305: C20.1 28.19,30.48 28.07,30.36 28.07,28.77 R21.1
N$83  (via drill 0.38)
  Top 0.305: U2.1 28.9,24.44 v29.72,23.62 30.23,24.13 CB21.1
  Bottom 0.305: CB20.1 29.97,23.88 v29.72,23.62
N$84  (via drill 0.38)
  Top 0.305: U2.3 27.24,22.92 v27.18,22.86
  Bottom 0.305: v27.18,22.86 27.39,23.07 CB12.1 27.43,24.64 27.43,25.91 CB11.1
  Bottom 0.406: FB3.2 27.69,26.48 CB11.1
N$87
  Top 0.305: U2.11 22.29,18.74 22.1,18.54 CB22.1
N$89  (via drill 0.38)
  Top 0.305: U2.16 25.97,20.77 v25.4,21.34
  Bottom 0.305: v25.4,21.34 23.88,22.86 R24.1
N$90  (via drill 0.38)
  Top 0.305: U2.15 25.34,20.13 v25.15,20.32
  Bottom 0.305: v25.15,20.32 24.64,20.83 R25.1
N$91
  Top 0.305: C24.1 21.46,16.51 21.84,16.89 22.99,16.89 23.43,17.34 U2.12
  Top 0.406: R23.1 21.44,16.44 C24.1
N$92
  Top 0.305: U2.14 24.7,15.98 CB13.1 25.21,15.47 CB14.1 | FB4.2 25.4,14.29 CB14.1 | R22.1 25.02,13.53 CB14.1
N$93
  Top 0.305: R22.2 23.37,16.13 24.07,16.83 U2.13
N$94
  Bottom 0.305: R24.2 21.91,24.41 C25.1
N$95  (via drill 0.38)
  Top 0.305: v20.57,21.08 19.62,21.08 T2.P$1
  Bottom 0.305: R25.2 20.83,20.83 v20.57,21.08
N$96  (via drill 0.38)
  Top 0.305: v18.29,24.38 19.37,24.38 T2.P$5
  Bottom 0.305: C25.2 18.67,24.77 v18.29,24.38
N$97
  Top 0.305: 21.21,31.11 21.21,26.16 22.8,24.57 U2.10 | 21.21,31.11 C23.1 21.4,30.99 18.29,30.99 | 21.21,31.11 21.21,35.63 POT2.2 | 18.29,30.99 17.78,30.99 17.53,31.24 R29.2 | 18.29,30.99 R28.1
N$98
  Top 0.406: R27.1 POT2.3
N$99
  Top 1.778: U$27.1 5.79,11.18 T3.P$4
N$100
  Top 1.778: RF_OUT.1 6.1,20.83 7.62,19.3 T3.P$3
N$101
  Top 0.813: SJ2.2 16.7,23.88 T2.P$4
N$102
  Top 0.813: SJ2.3 12.95,22.1 12.95,18.8 12.95,18.75
  Top 1.016: T3.P$1 12.75,19 12.95,18.8
N$109
  Bottom 0.305: Q4.1 R8.1 77.47,2.03 77.98,2.54 78.93,2.54 R9.2 C6.1
N$110
  Bottom 0.305: Q6.3 93.64,7.45 93.98,7.11 94.38,6.94 R3.1
N$111
  Bottom 0.305: Q4.3 75.69,7.62 77.72,7.62 78.15,7.2 80.03,7.2 R10.1
N$112
  Bottom 0.305: Q6.1 R1.1 92.71,2.03 93.22,2.54 94.17,2.54 R2.2 95.57,2.61 96.01,3.05 C5.1
N$113
  Bottom 1.016: Q1.E R4.2 90.64,11.3 CB5.1 90.34,11.18 L4.2 87.56,11.11 CB4.1
N$114
  Bottom 1.016: Q3.E R11.2 76.8,11.43 CB3.1 73.49,11.52 L6.1 69.02,11.43 CB2.1
RTY5
  Top 0.305: 14.22,31.5 R30.2 | 14.22,31.5 R29.1 | C38.1 14.22,31.5

### Text on the board
tPlace: GND | GND | GND | GND | GND